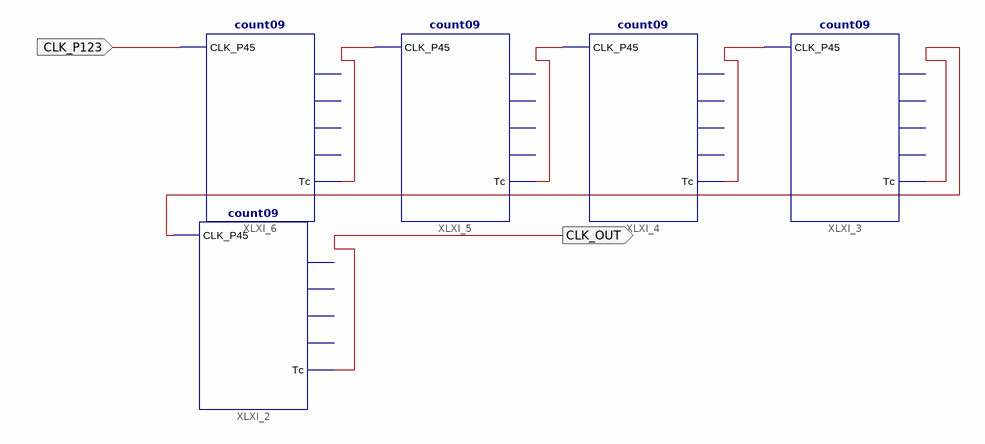
[diagram p0: schematic sheet 1]
// Xilinx ISE schematic div100k.sch (spartan6) as structural Verilog: 5 symbols, 2 ports
module div100k (
  input  CLK_P123,
  output CLK_OUT
);

  wire XLXN_13, XLXN_14, XLXN_15, XLXN_16;

  count09 XLXI_2 (.CLK_P45(XLXN_16), .Tc(CLK_OUT));  // open: Bit3_P79, Bit0_P82, Bit1_P81, Bit2_P80
  count09 XLXI_3 (.CLK_P45(XLXN_15), .Tc(XLXN_16));  // open: Bit3_P79, Bit0_P82, Bit1_P81, Bit2_P80
  count09 XLXI_4 (.CLK_P45(XLXN_14), .Tc(XLXN_15));  // open: Bit3_P79, Bit0_P82, Bit1_P81, Bit2_P80
  count09 XLXI_5 (.CLK_P45(XLXN_13), .Tc(XLXN_14));  // open: Bit3_P79, Bit0_P82, Bit1_P81, Bit2_P80
  count09 XLXI_6 (.CLK_P45(CLK_P123), .Tc(XLXN_13));  // open: Bit3_P79, Bit0_P82, Bit1_P81, Bit2_P80
endmodule
